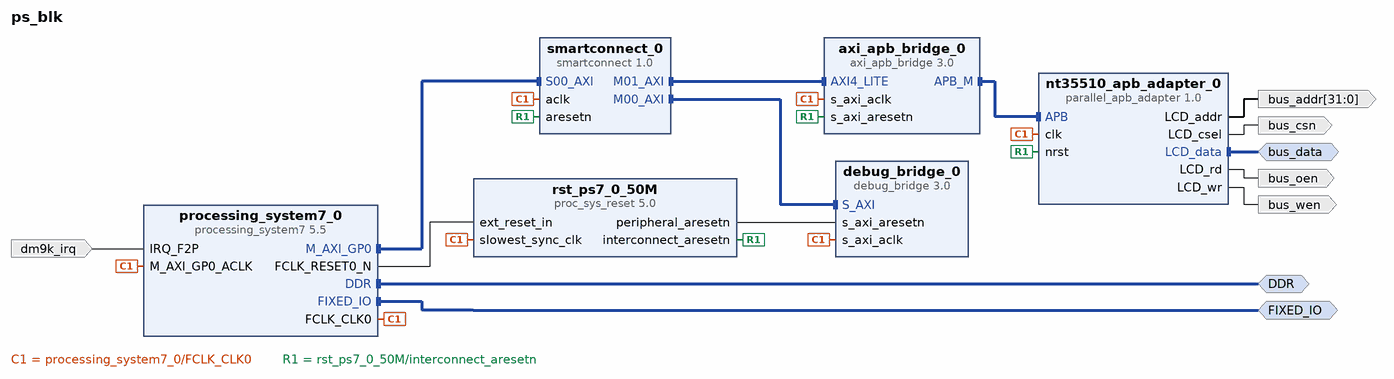
[diagram p0: block diagram of the top level]
# Vivado block design ps_blk, xc7z020clg484-2, Vivado 2017.3
create_bd_design ps_blk

create_bd_intf_port -mode Master -vlnv xilinx.com:interface:ddrx_rtl:1.0 DDR
create_bd_intf_port -mode Master -vlnv xilinx.com:display_processing_system7:fixedio_rtl:1.0 FIXED_IO
create_bd_intf_port -mode Master -vlnv xilinx.com:interface:gpio_rtl:1.0 bus_data
create_bd_port -dir I -type intr dm9k_irq
create_bd_port -dir O -from 31 -to 0 bus_addr
create_bd_port -dir O bus_oen
create_bd_port -dir O bus_wen
create_bd_port -dir O bus_csn

create_bd_cell -type ip -vlnv xilinx.com:ip:debug_bridge:3.0 debug_bridge_0
set_property -dict {CONFIG.C_DEBUG_MODE 2} [get_bd_cells debug_bridge_0]
create_bd_cell -type ip -vlnv xilinx.com:ip:processing_system7:5.5 processing_system7_0
set_property -dict [list \
  CONFIG.PCW_UIPARAM_DDR_FREQ_MHZ 533.333333 \
  CONFIG.PCW_CPU_CPU_6X4X_MAX_RANGE 767 \
  CONFIG.PCW_APU_PERIPHERAL_FREQMHZ 666.666666 \
  CONFIG.PCW_SDIO_PERIPHERAL_FREQMHZ 100 \
  CONFIG.PCW_UART_PERIPHERAL_FREQMHZ 100 \
  CONFIG.PCW_I2C_PERIPHERAL_FREQMHZ 111.111115 \
  CONFIG.PCW_FPGA0_PERIPHERAL_FREQMHZ 50 \
  CONFIG.PCW_FPGA1_PERIPHERAL_FREQMHZ 50 \
  CONFIG.PCW_M_AXI_GP0_FREQMHZ 50 \
  CONFIG.PCW_USE_FABRIC_INTERRUPT 1 \
  CONFIG.PCW_NUM_F2P_INTR_INPUTS 1 \
  CONFIG.PCW_IRQ_F2P_INTR 1 \
  CONFIG.PCW_GP0_EN_MODIFIABLE_TXN 0 \
  CONFIG.PCW_GP1_EN_MODIFIABLE_TXN 0 \
  CONFIG.PCW_PERIPHERAL_BOARD_PRESET None \
  CONFIG.PCW_PRESET_BANK1_VOLTAGE {LVCMOS 3.3V} \
  CONFIG.PCW_UIPARAM_DDR_BUS_WIDTH {16 Bit} \
  CONFIG.PCW_UIPARAM_DDR_PARTNO {MT41K256M16 RE-125} \
  CONFIG.PCW_QSPI_PERIPHERAL_ENABLE 1 \
  CONFIG.PCW_QSPI_QSPI_IO {MIO 1 .. 6} \
  CONFIG.PCW_QSPI_GRP_SINGLE_SS_ENABLE 1 \
  CONFIG.PCW_QSPI_GRP_SINGLE_SS_IO {MIO 1 .. 6} \
  CONFIG.PCW_SINGLE_QSPI_DATA_MODE x4 \
  CONFIG.PCW_ENET0_PERIPHERAL_ENABLE 0 \
  CONFIG.PCW_SD0_PERIPHERAL_ENABLE 1 \
  CONFIG.PCW_SD0_SD0_IO {MIO 16 .. 21} \
  CONFIG.PCW_SD0_GRP_CD_ENABLE 0 \
  CONFIG.PCW_SD0_GRP_WP_ENABLE 0 \
  CONFIG.PCW_UART0_PERIPHERAL_ENABLE 1 \
  CONFIG.PCW_UART0_UART0_IO {MIO 26 .. 27} \
  CONFIG.PCW_UART1_PERIPHERAL_ENABLE 0 \
  CONFIG.PCW_USB0_PERIPHERAL_ENABLE 1 \
  CONFIG.PCW_USB0_USB0_IO {MIO 28 .. 39} \
  CONFIG.PCW_USB_RESET_ENABLE 1 \
  CONFIG.PCW_USB_RESET_SELECT {Share reset pin} \
  CONFIG.PCW_USB0_RESET_ENABLE 0 \
  CONFIG.PCW_USB1_PERIPHERAL_ENABLE 1 \
  CONFIG.PCW_USB1_USB1_IO {MIO 40 .. 51} \
  CONFIG.PCW_I2C1_PERIPHERAL_ENABLE 1 \
  CONFIG.PCW_I2C1_I2C1_IO {MIO 12 .. 13} \
  CONFIG.PCW_I2C_RESET_ENABLE 1 \
  CONFIG.PCW_I2C_RESET_SELECT {Share reset pin} \
  CONFIG.PCW_GPIO_MIO_GPIO_ENABLE 1 \
  CONFIG.PCW_GPIO_MIO_GPIO_IO MIO \
  CONFIG.PCW_GPIO_EMIO_GPIO_ENABLE 1 \
  CONFIG.PCW_GPIO_EMIO_GPIO_IO 64 \
] [get_bd_cells processing_system7_0]
# 513 more settings of processing_system7_0 are not shown: defaults, MIO pin electricals, DDR timing, and values the tool derives
create_bd_cell -type ip -vlnv xilinx.com:ip:proc_sys_reset:5.0 rst_ps7_0_50M
create_bd_cell -type ip -vlnv xilinx.com:ip:smartconnect:1.0 smartconnect_0
set_property -dict {CONFIG.NUM_MI 2 CONFIG.NUM_SI 1} [get_bd_cells smartconnect_0]
create_bd_cell -type ip -vlnv user.org:user:parallel_apb_adapter:1.0 nt35510_apb_adapter_0
set_property -dict {CONFIG.NT35510_RD_CYCLE 50 CONFIG.NT35510_WR_CYCLE 5} [get_bd_cells nt35510_apb_adapter_0]
create_bd_cell -type ip -vlnv xilinx.com:ip:axi_apb_bridge:3.0 axi_apb_bridge_0
set_property -dict {CONFIG.C_M_APB_PROTOCOL apb4 CONFIG.C_APB_NUM_SLAVES 1} [get_bd_cells axi_apb_bridge_0]

# ---- connections ----

connect_bd_intf_net [get_bd_intf_pins smartconnect_0/M00_AXI] [get_bd_intf_pins debug_bridge_0/S_AXI]
connect_bd_intf_net [get_bd_intf_pins smartconnect_0/S00_AXI] [get_bd_intf_pins processing_system7_0/M_AXI_GP0]
connect_bd_intf_net [get_bd_intf_pins axi_apb_bridge_0/APB_M] [get_bd_intf_pins nt35510_apb_adapter_0/APB]
connect_bd_intf_net [get_bd_intf_pins axi_apb_bridge_0/AXI4_LITE] [get_bd_intf_pins smartconnect_0/M01_AXI]
connect_bd_intf_net [get_bd_intf_ports DDR] [get_bd_intf_pins processing_system7_0/DDR]
connect_bd_intf_net [get_bd_intf_ports FIXED_IO] [get_bd_intf_pins processing_system7_0/FIXED_IO]
connect_bd_intf_net [get_bd_intf_ports bus_data] [get_bd_intf_pins nt35510_apb_adapter_0/LCD_data]
connect_bd_net [get_bd_pins processing_system7_0/FCLK_CLK0] \
  [get_bd_pins debug_bridge_0/s_axi_aclk] [get_bd_pins processing_system7_0/M_AXI_GP0_ACLK] \
  [get_bd_pins rst_ps7_0_50M/slowest_sync_clk] [get_bd_pins smartconnect_0/aclk] [get_bd_pins axi_apb_bridge_0/s_axi_aclk] \
  [get_bd_pins nt35510_apb_adapter_0/clk]
connect_bd_net [get_bd_pins processing_system7_0/FCLK_RESET0_N] [get_bd_pins rst_ps7_0_50M/ext_reset_in]
connect_bd_net [get_bd_pins rst_ps7_0_50M/interconnect_aresetn] \
  [get_bd_pins smartconnect_0/aresetn] [get_bd_pins axi_apb_bridge_0/s_axi_aresetn] [get_bd_pins nt35510_apb_adapter_0/nrst]
connect_bd_net [get_bd_pins rst_ps7_0_50M/peripheral_aresetn] [get_bd_pins debug_bridge_0/s_axi_aresetn]
connect_bd_net [get_bd_ports dm9k_irq] [get_bd_pins processing_system7_0/IRQ_F2P]
connect_bd_net [get_bd_pins nt35510_apb_adapter_0/LCD_addr] [get_bd_ports bus_addr]
connect_bd_net [get_bd_pins nt35510_apb_adapter_0/LCD_rd] [get_bd_ports bus_oen]
connect_bd_net [get_bd_pins nt35510_apb_adapter_0/LCD_wr] [get_bd_ports bus_wen]
connect_bd_net [get_bd_pins nt35510_apb_adapter_0/LCD_csel] [get_bd_ports bus_csn]

# ---- address map ----
assign_bd_address -offset 0x43C00000 -range 64K -target_address_space [get_bd_addr_spaces processing_system7_0/Data] [get_bd_addr_segs debug_bridge_0/S_AXI/Reg0]
assign_bd_address -offset 0x44000000 -range 32M -target_address_space [get_bd_addr_spaces processing_system7_0/Data] [get_bd_addr_segs nt35510_apb_adapter_0/APB/Ctrl]

validate_bd_design
save_bd_design
